# EAGLE schematic bic_sheild_draft1 (EAGLE 8.5.2)
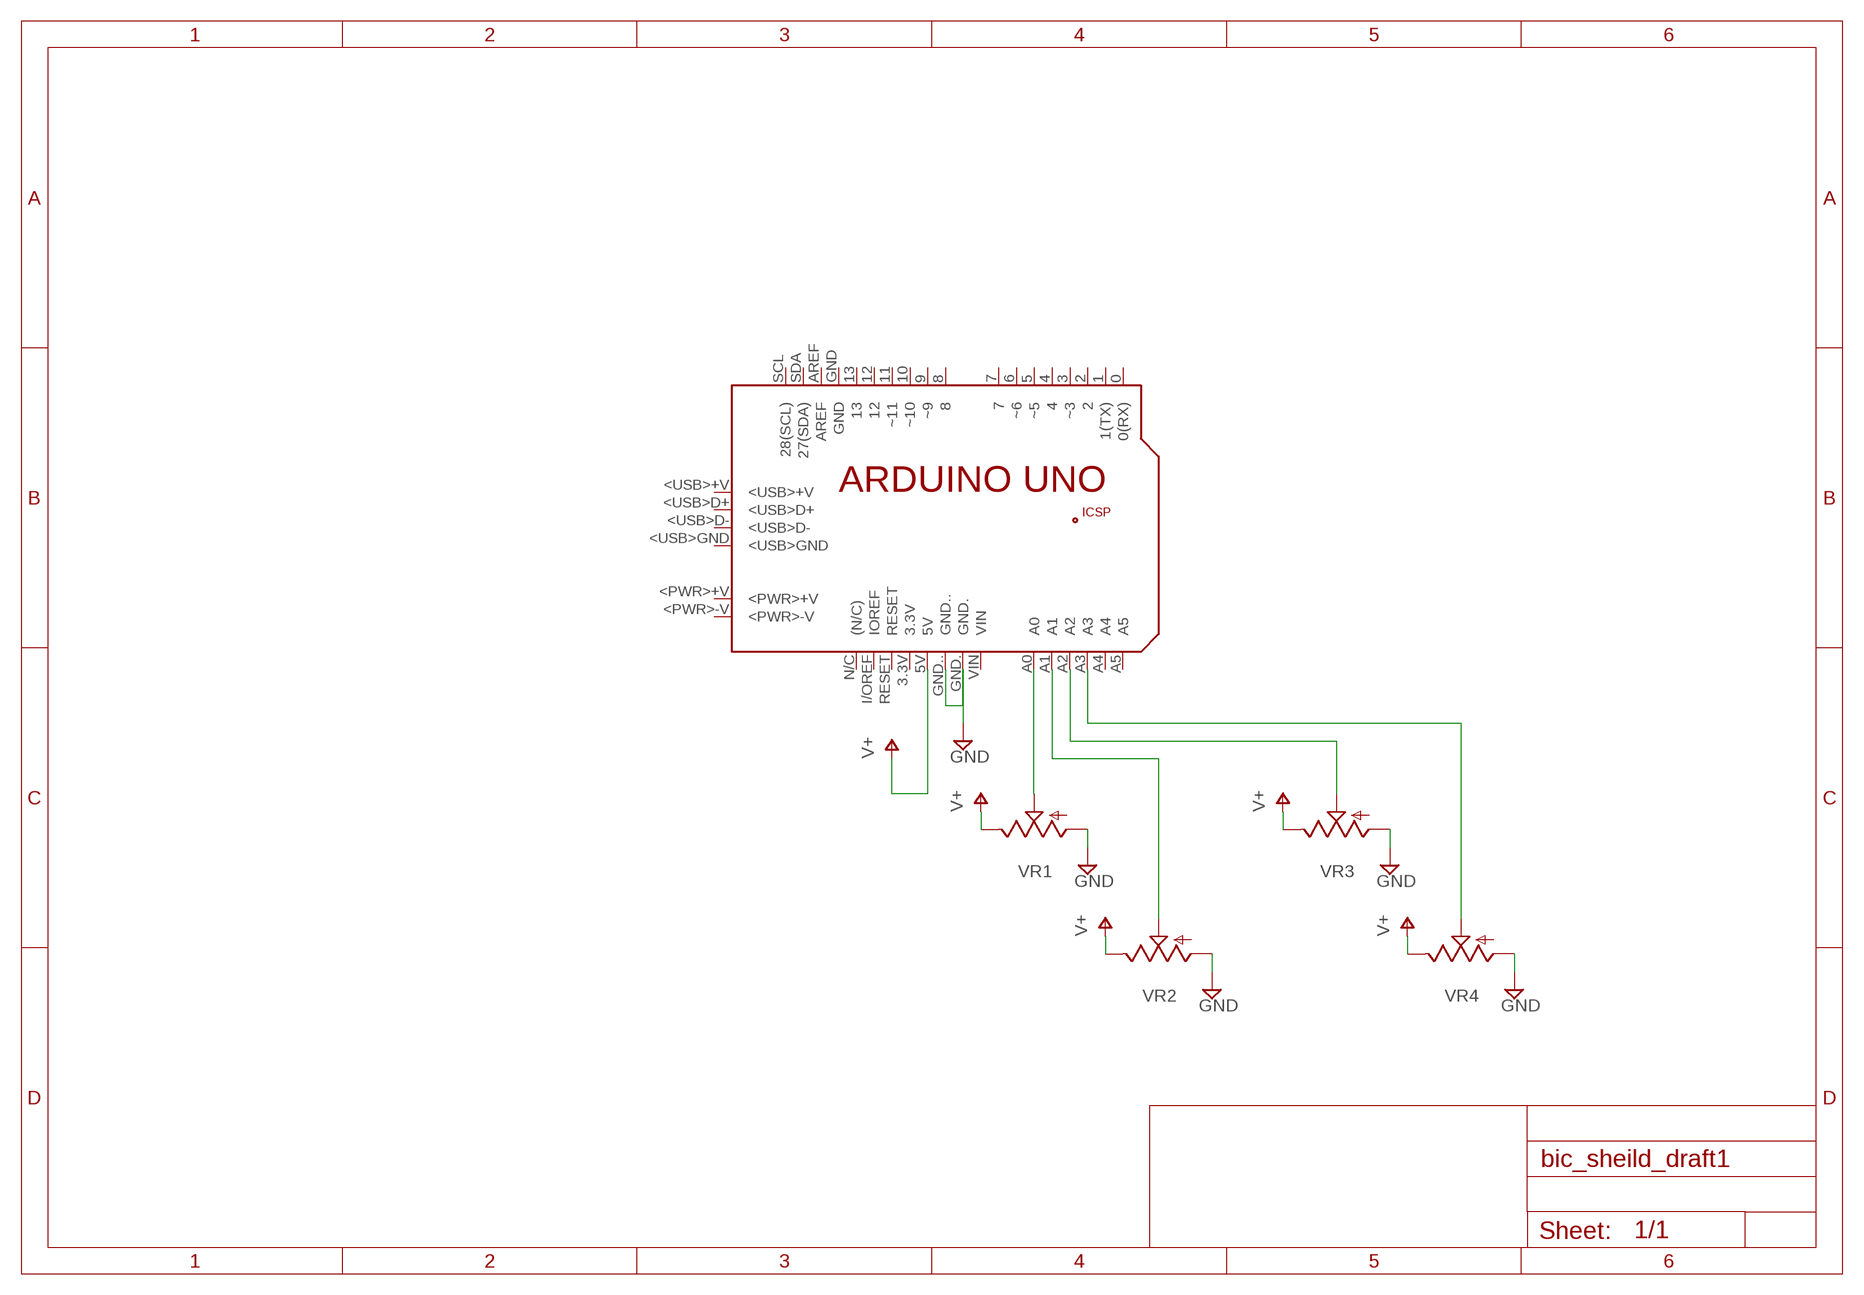
[diagram p0: schematic, sheet 1]

## Parts
PCB1  ARDUINO_UNO  [ARDUINO_UNO]
VR1  9MM_SNAP-IN_POT_  [9MM_SNAP-IN_POT]
VR2  9MM_SNAP-IN_POT_  [9MM_SNAP-IN_POT]
VR3  9MM_SNAP-IN_POT_  [9MM_SNAP-IN_POT]
VR4  9MM_SNAP-IN_POT_  [9MM_SNAP-IN_POT]

## Nets
GND: PCB1.GND. PCB1.GND.. VR1.1(A) VR2.1(A) VR3.1(A) VR4.1(A)
N$9: PCB1.A0 VR1.2(S)
N$10: PCB1.A1 VR2.2(S)
N$11: PCB1.A2 VR3.2(S)
N$12: PCB1.A3 VR4.2(S)
V+: PCB1.5V VR1.3(E) VR2.3(E) VR3.3(E) VR4.3(E)
Unconnected: PCB1.0(0(RX)) PCB1.1(1(TX)) PCB1.2 PCB1.3(~3) PCB1.3.3V PCB1.4 PCB1.5(~5) PCB1.6(~6) PCB1.7 PCB1.8 PCB1.9(~9) PCB1.10(~10) PCB1.11(~11) PCB1.12 PCB1.13 PCB1.+5V PCB1.<PWR>+V PCB1.<PWR>-V PCB1.<USB>+V PCB1.<USB>D+ PCB1.<USB>D- PCB1.<USB>GND PCB1.A4 PCB1.A5 PCB1.AREF PCB1.GND PCB1.GND_ PCB1.I/OREF(IOREF) PCB1.MISO PCB1.MOSI PCB1.N/C((N/C)) PCB1.RESET PCB1.RESET. PCB1.SCK PCB1.SCL(28(SCL)) PCB1.SDA(27(SDA)) PCB1.VIN

## Library data of the parts
PCB1 = Arduino:ARDUINO_UNO: Device for representing an Arduino Uno board with a footprint in an EAGLE design. Created by Dave Young for Element14. More EAGLE documentation at: http://www.element14.com/community/community/knode/cadsoft_eagle
VR1-VR4 = MusicThingModular:9MM_SNAP-IN_POT: 9mm vertical snap-in pot, Alpha / Panasonic style